# EAGLE schematic watch (EAGLE 6.4)
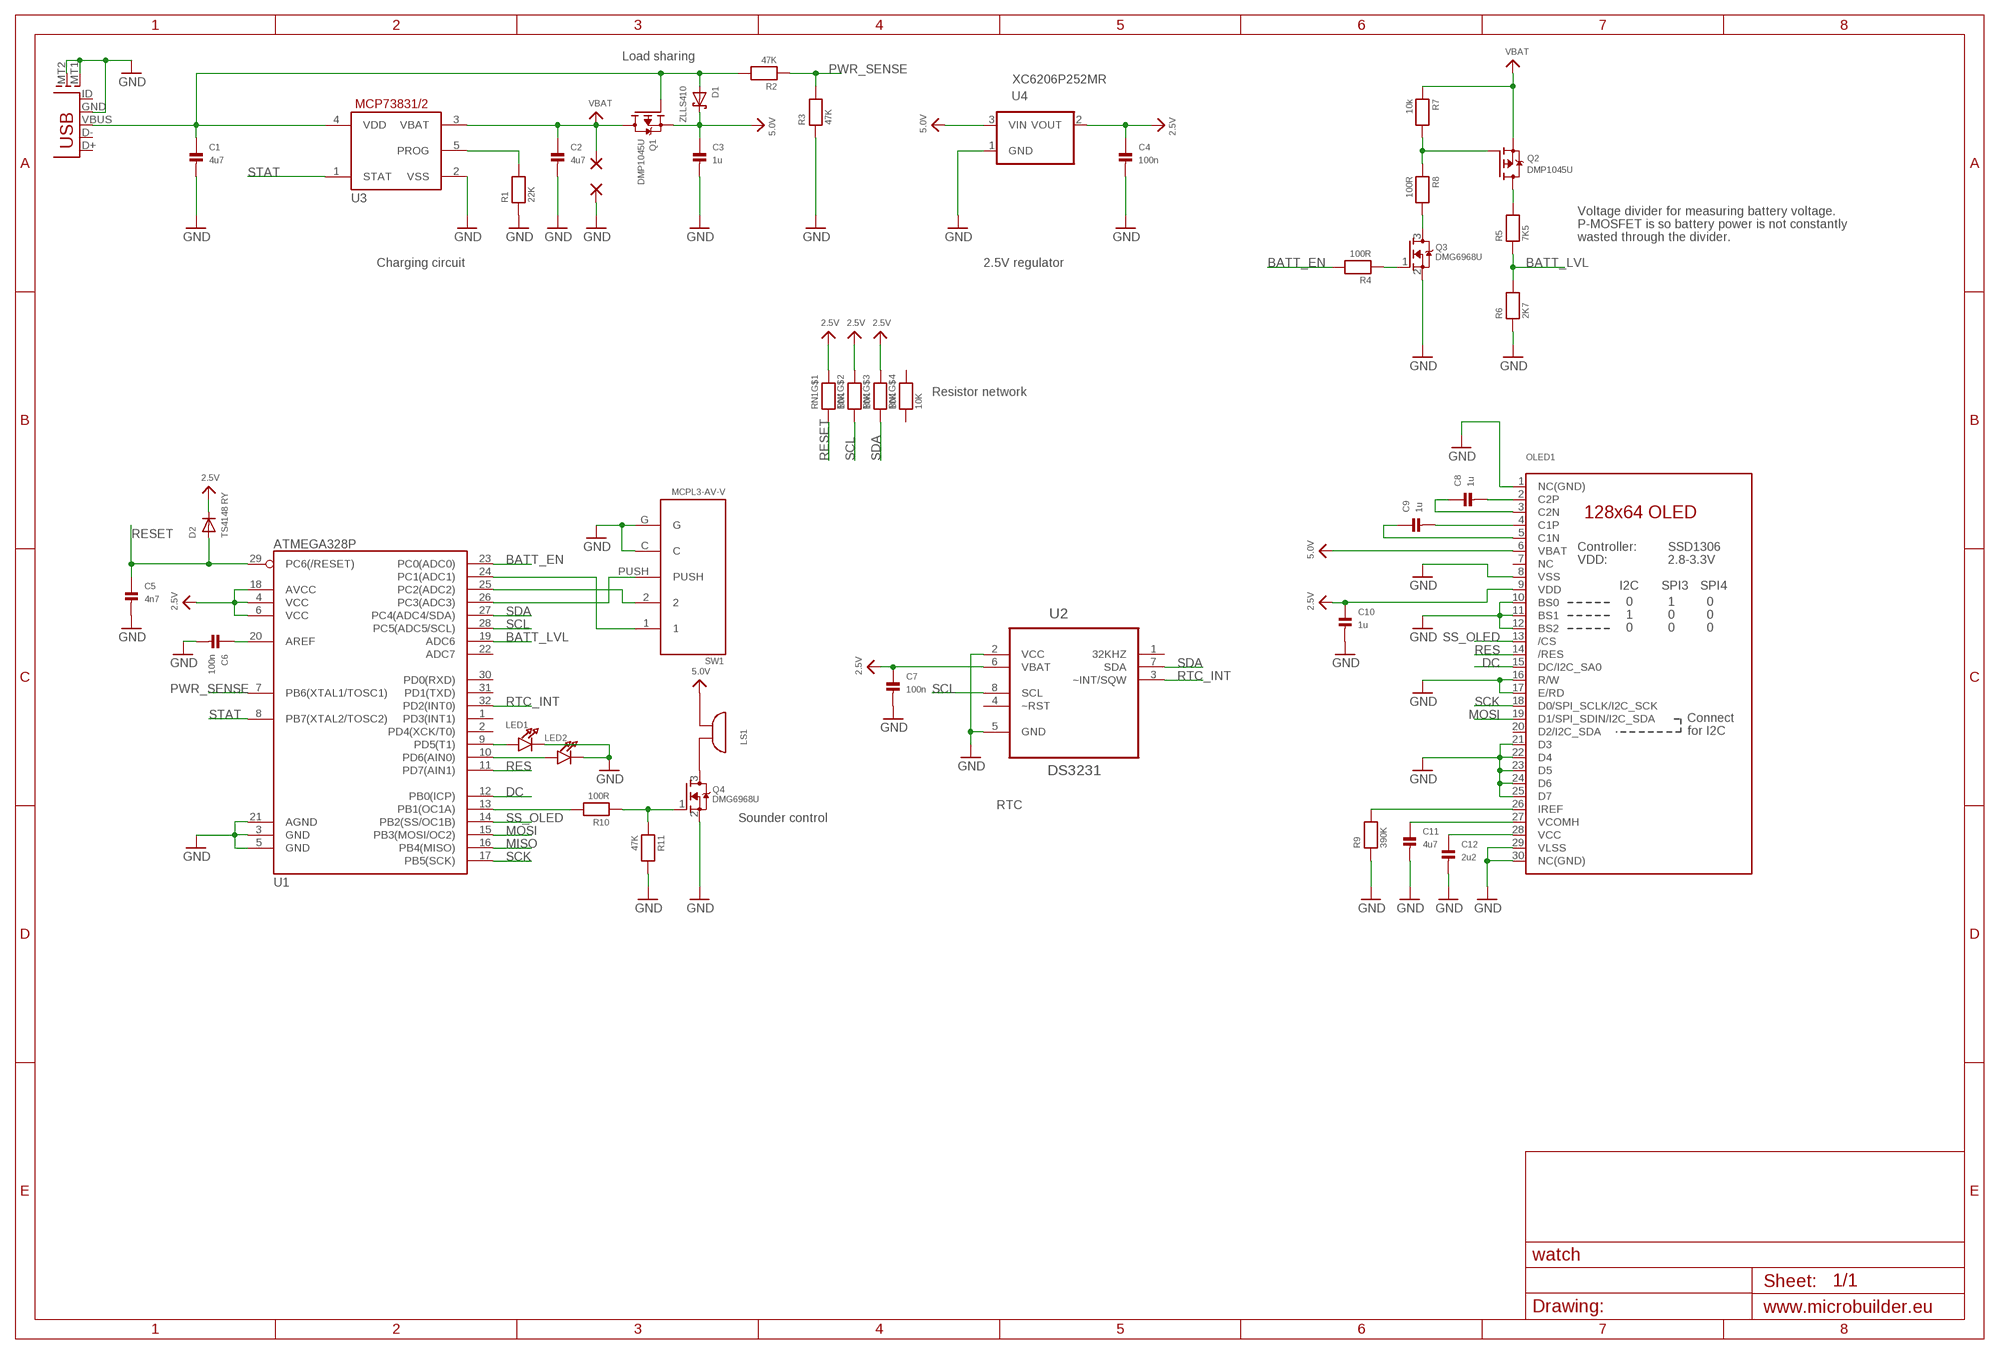
[diagram p0: schematic, sheet 1]

## Parts
C1  4u7  CAP_CERAMIC0805  [0805]
C2  4u7  CAP_CERAMIC0805  [0805]
C3  1u  CAP_CERAMIC0805  [0805]
C4  100n  CAP_CERAMIC0805  [0805]
C5  4n7  CAP_CERAMIC0805  [0805]
C6  100n  CAP_CERAMIC0805  [0805]
C7  100n  CAP_CERAMIC0805  [0805]
C8  1u  CAP_CERAMIC0805  [0805]
C9  1u  CAP_CERAMIC0805  [0805]
C10  1u  CAP_CERAMIC0805  [0805]
C11  4u7  CAP_CERAMIC0805  [0805]
C12  2u2  CAP_CERAMIC0805  [0805]
D1  ZLLS410  DIODE-SCHOTTKYSOD-323  [SOD-323]
D2  TS4148 RY  DIODE0805  [DIODE0805]
LED1  LED0805  [CHIPLED_0805]
LED2  LED0805  [CHIPLED_0805]
LS1  ABMT-801-RC  [PIEZO]
OLED1  DISP_OLED_UG-2864HSWEG01_NOOUTLINE  [UG-2864HSWEG01_1.3_WRAPAROUND]
PAD1  SMD2  [SMD1,27-2,54]
PAD2  SMD2  [SMD1,27-2,54]
Q1  DMP1045U  MOSFET-PWIDE  [SOT23-WIDE]
Q2  DMP1045U  MOSFET-PWIDE  [SOT23-WIDE]
Q3  DMG6968U  MOSFET-NWIDE  [SOT23-WIDE]
Q4  DMG6968U  MOSFET-NWIDE  [SOT23-WIDE]
R1  22K  RESISTOR0805  [0805]
R2  47K  RESISTOR0805_NOTHERMALS  [0805_NOTHERMALS]
R3  47K  RESISTOR0805_NOTHERMALS  [0805_NOTHERMALS]
R4  100R  RESISTOR0805  [0805]
R5  7K5  RESISTOR0805  [0805]
R6  2K7  RESISTOR0805  [0805]
R7  10k  RESISTOR0805  [0805]
R8  100R  RESISTOR0805  [0805]
R9  390K  RESISTOR0805  [0805]
R10  100R  RESISTOR0805  [0805]
R11  47K  RESISTOR0805  [0805]
RN1  10K  RESISTOR_4PACK  [RESPACK_4X0603]
SW1  MCPL3-AV-V  [MCPL3-AC-V]
U1  ATMEGA328P  ATMEGA328_SMT  [TQFP32-08]
U2  DS3231  DS3231MZ+  [SOIC8_150MIL]
U3  MCP73832T-2ACI/OT  MCP73831/OT  [SOT23-5L]
U4  XC6206P252MR  MCP1700T-2502E/TTWIDE_PAD  [SOT-23]
USB1  USB-MICROBLARGEPAD  [USB-MICROB_LARGEPAD]

## Nets
2.5V: C4.1 C7.1 C10.1 D2.2(C) OLED1.9(VDD) RN1.6 RN1.7 RN1.8 U1.4(VCC) U1.6(VCC) U1.18(AVCC) U2.6(VBAT) U4.2(VOUT)
5.0V: C3.1 D1.C LS1.1(VCC) OLED1.6(VBAT) Q1.2(S) U4.3(VIN)
BATT_EN: R4.2 U1.23(PC0(ADC0))
BATT_LVL: R5.1 R6.2 U1.19(ADC6)
DC: OLED1.15(DC/I2C_SA0) U1.12(PB0(ICP))
GND: C1.2 C2.2 C3.2 C4.2 C5.2 C6.2 C7.2 C10.2 C11.2 C12.2 LED1.C LED2.C OLED1.1(NC(GND)) OLED1.8(VSS) OLED1.10(BS0) OLED1.11(BS1) OLED1.12(BS2) OLED1.16(R/W) OLED1.17(E/RD) OLED1.21(D3) OLED1.22(D4) OLED1.23(D5) OLED1.24(D6) OLED1.25(D7) OLED1.29(VLSS) OLED1.30(NC(GND)) PAD2.1(P) Q3.2(S) Q4.2(S) R1.1 R3.1 R6.1 R9.1 R11.2 SW1.C SW1.G U1.3(GND) U1.5(GND) U1.21(AGND) U2.2(VCC) U2.5(GND) U3.2(VSS) U4.1(GND) USB1.GND USB1.MT1(SHEILD1) USB1.MT2(SHEILD2)
MISO: U1.16(PB4(MISO))
MOSI: OLED1.19(D1/SPI_SDIN/I2C_SDA) U1.15(PB3(MOSI/OC2))
N$1: C6.1 U1.20(AREF)
N$2: SW1.1 U1.24(PC1(ADC1))
N$3: C8.2 OLED1.2(C2P)
N$4: SW1.2 U1.25(PC2(ADC2))
N$5: OLED1.26(IREF) R9.2
N$6: C1.1 D1.A Q1.1(G) R2.2 U3.4(VDD) USB1.VBUS
N$7: LS1.2(GND) Q4.3(D)
N$8: Q4.1(G) R10.1 R11.1
N$9: SW1.PUSH U1.26(PC3(ADC3))
N$10: R1.2 U3.5(PROG)
N$11: LED1.A U1.9(PD5(T1))
N$12: Q2.1(G) R7.2 R8.1
N$13: C9.1 OLED1.5(C1N)
N$14: C9.2 OLED1.4(C1P)
N$15: C8.1 OLED1.3(C2N)
N$16: LED2.A U1.10(PD6(AIN0))
N$17: Q3.3(D) R8.2
N$18: Q2.3(D) R5.2
N$19: C11.1 OLED1.27(VCOMH)
N$20: C12.1 OLED1.28(VCC)
N$21: Q3.1(G) R4.1
PIEZO: R10.2 U1.13(PB1(OC1A))
PWR_SENSE: R2.1 R3.2 U1.7(PB6(XTAL1/TOSC1))
RES: OLED1.14(/RES) U1.11(PD7(AIN1))
RESET: C5.1 D2.1(A) RN1.1 U1.29(PC6(/RESET))
RTC_INT: U1.32(PD2(INT0)) U2.3(~INT/SQW)
SCK: OLED1.18(D0/SPI_SCLK/I2C_SCK) U1.17(PB5(SCK))
SCL: RN1.2 U1.28(PC5(ADC5/SCL)) U2.8(SCL)
SDA: RN1.3 U1.27(PC4(ADC4/SDA)) U2.7(SDA)
SS_OLED: OLED1.13(/CS) U1.14(PB2(SS/OC1B))
STAT: U1.8(PB7(XTAL2/TOSC2)) U3.1(STAT)
VBAT: C2.1 PAD1.1(P) Q1.3(D) Q2.2(S) R7.1 U3.3(VBAT)
Unconnected: OLED1.7(NC) OLED1.20(D2/I2C_SDA) RN1.4 RN1.5 U1.1(PD3(INT1)) U1.2(PD4(XCK/T0)) U1.22(ADC7) U1.30(PD0(RXD)) U1.31(PD1(TXD)) U2.1(32KHZ) U2.4(~RST) USB1.D+ USB1.D- USB1.ID

## Notes on the sheet
- Load sharing
- Voltage divider for measuring battery voltage.
- P-MOSFET is so battery power is not constantly
- wasted through the divider.
- Charging circuit | 2.5V regulator
- Resistor network
- RTC
- Sounder control

## Library data of the parts
C1-C12 = microbuilder:CAP_CERAMIC: Ceramic Capacitors 0402 - 0402 Surface Mount Capacitors 16pF 50V 5% [Digikey: 445-4899-2-ND] 18pF 50V 5% [Digikey: 490-1281-2-ND] 22pF 50V 5% [Digikey: 490-1283-2-ND] 68pF 50V 5% [Digikey: 490-1289-2-ND] 0.1uF 10V 10% [Digikey: 490-1318-2-ND] 1.0uF 6.3V 10% [Digikey: 490-1320-2-ND] 0603 - 0603 Surface Mount Capacitors 16 pF 50V 5% [Digikey: 445-5051-2-ND] 22 pF 50V [Digikey: PCC220ACVTR-ND] 33 pF 50V 5% [Digikey: 490-1415-1-ND] 56pF 50V 5% [Digikey: 490-1421-1-ND] 220pF 50V 5% [Digikey: 445-1285-1-ND] 680 pF 50V 2200 pF 50V 5% C0G [Digikey: 445-1297-1-ND] 5600 pF 100V 5% X7R [Digikey: 478-3711-1-ND] 0.1 µF 25V 10% [Digikey: PCC2277TR-ND] 0.22 µF 16V 10% X7R [Digikey: 445-1318-1-ND] 1.0 µF 25V 10% [Digikey: 445-5146-2-ND] 0603 - RF Specific 3pF 250V +/-0.1pF RF [Digikey: 712-1347-1-ND] 18 pF 250V 5% [Digikey: 478-3505-1-ND or 712-1322-1-ND] 56 pF 250V 5% C0G RF [Digikey: 490-4867-1-ND] 68 pF 250V RF [Digikey: 490-4868-1-ND] 0805 - 0805 Surface Mount Capacitors 220 pF 250V 2% RF Ceramic Capacitor [Digikey: 712-1398-1-ND] 1000 pF 50V 2% NP0 Ceramic Capacitor [Digikey: 478-3760-1-ND] 0.1 µF 25V 10% Ceramic Capacitor [Digikey: PCC1828TR-ND] 1.0 µF 16V 10% Ceramic Capacitor[Digikey: 490-1691-2-ND] 10.0 µF 10V 10% Ceramic Capacitor[Digikey: 709-1228-1-ND] 10.0 uF 16V 10% Ceramic Capacitor [Digikey: 478-5165-2-ND] 47 uF 6.3V 20% Ceramic Capacitor [Digikey: 587-1779-1-ND or 399-5506-1-ND] 1206 - 1206 Surface Mount Capacitors 47uF 10V 20% Ceramic Capacitor [Digikey: 490-5528-1-ND or 399-5508-1-ND or 445-6010-1-ND] 100uF 6.3V -20%, +80% Y5V Ceramic Capacitor (Digikey: 490-4512-1-ND, Mouser: 81-GRM31CF50J107ZE1L)
D1 = zak:DIODE-SCHOTTKY
D2 = diode0805:DIODE0805
LED1 LED2 = microbuilder:LED: LED 0603 - 0603 Surface Mount Package 2mA: Green LED - Low Power (3.9mcd, 2ma, 1.7Vf) - Digikey: 475-2709-2-ND Orange LED - Low Power (9.8mcd, 2ma, 1.8Vf) - Digikey: 475-1194-2-ND Red LED - Low Power (5mcd, 2ma, 1.8Vf) - Digikey: 475-1195-2-ND Yellow LED - Low Power (7mcd, 2ma, 1.8Vf) - Digikey: 475-1196-2-ND 5mA: Blue LED - Low Power (17mcd, 5ma, 2.9Vf) - Digikey: LNJ937W8CRACT-ND 0805 - 0805 Surface Mount Package 2mA: Red LED (8.8mcd, 2mA, 1.8Vf, Clear) - Low Power [Digikey: 475-2510-1-ND] Green LED (5mcd, 2mA, 1.8Vf, Clear) - Low Power [Digikey: 475-2730-1-ND] Yellow LED (11.3mcd, 2mA, 1.8Vf, Clear) - Low Power [Digikey: 475-2555-1-ND] 20mA: Red LED (104mcd, 20mA, Diffused) - LS R976 [Digikey: 475-1278-6-ND] Red LED (12mcd, 20mA, 2.0Vf, Clear) - APT2012EC [Digikey: 754-1128-1-ND] Green LED (15mcd, 20mA, 2.2Vf, Clear) - APT2012GC [Digikey: 754-1131-1-ND] Orange LED (160mcd, 20mA, 2.1Vf, Clear) - APT2012SECK [Digikey: 754-1130-1-ND] 1206 - 1206 Surface Mount Package Green LED (26mcd, 20mA, Diffused) - LG N971 [Digikey: 475-1407-6-ND] Red LED (15mcd, 20mA, Diffused) - LH N974 [Digikey: 475-1416-6-ND]
LS1 = zak:ABMT-801-RC
OLED1 = zak:DISP_OLED_UG-2864HSWEG01_NOOUTLINE
PAD1 PAD2 = wirepad:SMD2: SMD PAD
Q1 Q2 = microbuilder:MOSFET-P: P-Channel Mosfet LEGEND VDS: Voltage Drain-Source ID: Drain Current RDS(ON): Drain-Source On-State Resistance VGS(TH): Gate-Source Threshold Voltage CISS: Drain-Source Input Capacitance SOT-23 Name VDS ID RDS(ON) VGS(TH) CISS Order Number IRLML5103 30V 760mA 600 mOhm -- 75pF @ 25V Digikey: IRLML5103PBFCT-ND IRLML6401 12V 4.3A 50 mOhm 950mV @ 250µA 830pF @ 10V Digikey: IRLML6401PBFTR-ND NTR0202PL 20V 400mA 800 mOhm 2.3V @ 250uA 70pF @ 5V Digikey: NTR0202PLT1GOSTR-ND NTR4101PT1G 20V 1.8A 85 mOhm 1.2V @ 250uA 675pF @ 10V Digikey: NTR4101PT1GOSCT-ND DMP2004K 20V 600mA 900 mOhm 1V @ 250uA 175pF @ 16V Digikey: DMP2004KDICT-ND PMV65XP 20V 3.9A 76 mOhm 950mV @ 1mA 725pF @ 20V Digikey: 568-2358-2-ND TO-252 Name VDS ID RDS(ON) VGS(TH) CISS Order Number AOD417 30V 25A 34 mOhm 3V @ 250µA 920pF @ 15V Digikey: 785-1106-2-ND
Q3 Q4 = microbuilder:MOSFET-N: N-Channel Mosfet LEGEND VDS: Voltage Drain-Source ID: Drain Current RDS(ON): Drain-Source On-State Resistance VGS(TH): Gate-Source Threshold Voltage CISS: Drain-Source Input Capacitance SOT-23 Name VDS ID RDS(ON) VGS(TH) CISS Order Number 2N7002E 60V 260mA 2.5 Ohm 2.5V @ 250uA 26.7pF @ 25V 2N7002ET1GOSTR-ND BSH103 30V 850mA 400 mOhm 400mV @ 1mA 83pF @ 24V BSH103,235-ND BSS138 60V 320mA 1.6 Ohm 1.5V @ 250uA 50pF @ 10V Mouser: 771-BSS138PW115 DMN2075U-7 20V 4.2A 38 mOhm 1V @ 250 uA 594.3pF @ 10V DMN2075U-7DICT-ND * BSS138 good choice for I2C level-shifting
R1-R11 = microbuilder:RESISTOR: Resistors 0402 - 0402 Surface Mount Package 22 Ohm 1% 1/16W [Digikey: 311-22.0LRTR-ND] 33 Ohm 5% 1/16W 1.0K 5% 1/16W 1.5K 5% 1/16W 2.0K 1% 1/16W 10.0K 1% 1/16W [Digikey: 311-10.0KLRTR-ND] 10.0K 5% 1/16W [Digikey: RMCF0402JT10K0TR-ND] 12.1K 1% 1/16W [Digikey: 311-22.0LRTR-ND] 100.0K 5% 1/16W 0603 - 0603 Surface Mount Package 0 Ohm 1/10 Watt 1% Resistor 15 Ohm 1/10 Watt 1% Resistor 33 Ohm 1/10 Watt 1% Resistor 49.9 Ohm 1/10 Watt 1% Resistor 100 Ohm 1/10 Watt 1% Resistor 150 Ohm 1/10 Watt 1% Resistor 240 Ohm 1/10 Watt 1% Resistor 390 Ohm 1/10 Watt 1% Resistor 560 Ohm 1/10 Watt 1% Resistor 680 Ohm 1/10 Watt 1% Resistor 750 Ohm 1/10 Watt 1% Resistor 1.0K Ohm 1/10 Watt 1% Resistor 1.5K Ohm 1/10 Watt 1% Resistor 2.0K Ohm 1/10 Watt 1% Resistor 2.2K Ohm 1/10 Watt 1% Resistor 3.3K Ohm 1/10 Watt 1% Resistor 4.7K Ohm 1/10 Watt 1% Resistor 10.0K Ohm 1/10 Watt 1% Resistor 12.0K Ohm 1/10 Watt 1% Resistor 12.1K Ohm 1/10 Watt 1% Resistor 20.0K Ohm 1/10 Watt 1% Resistor 33.0K Ohm 1/10 Watt 1% Resistor 100.0K Ohm 1/10 Watt 1% Resistor 0805 - 0805 Surface Mount Package 0 Ohm 1/8 Watt 1% Resistor 33 Ohm 1/8 Watt 1% Resistor 100 Ohm 1/8 Watt 1% Resistor 150 Ohm 1/8 Watt 1% Resistor 200 Ohm 1/8 Watt 1% Resistor 240 Ohm 1/8 Watt 1% Resistor 330 Ohm 1/8 Watt 1% Resistor 390 Ohm 1/8 Watt 1% Resistor 470 Ohm 1/8 Watt 1% Resistor 1.0K Ohm 1/8 Watt 1% Resistor 1.5K Ohm 1/8 Watt 1% Resistor 2.0K Ohm 1/8 Watt 1% Resistor 4.7K Ohm 1/8 Watt 1% Resistor 5.1K Ohm 1/8 Watt 1% Resistor 5.6K Ohm 1/8 Watt 1% Resistor 10.0K Ohm 1/8 Watt 1% Resistor 22.0K Ohm 1/8 Watt 1% Resistor 33.0K Ohm 1/8 Watt 1% Resistor 100K Ohm 1/8 Watt 1% Resistor 1206 - 1206 Surface Mount Package 2012 - 2010 Surface Mount Package 0.11 Ohm 1/2 Watt 1% Resistor - Digikey: RHM.11UCT-ND
RN1 = microbuilder:RESISTOR_4PACK: Resistor Packs (4 resistors) 4 x 0603 10K 1/16W - Digikey: YC164J-10KCT-ND
SW1 = zak:MCPL3-AV-V
U1 = SparkFun-DigitalIC:ATMEGA328_SMT: 32-Pin Atmega328 part Commonly used on Arduino compatible boards Available in QFP and QFN packages TQFP is IC-09069 QFN is non-stock; PROD_ID: IC-09069
U2 = zak:DS3231MZ+
U3 = adafruit:MCP73831: MCP73831/2 Miniature Single-Cell, Fully Integrated Li-Ion, Li-Polymer Charge Management Controllers. Nice and small simple lipoly charge controller, with adjustable current and status output (LED) http://www.ladyada.net/library/pcb/eaglelibrary.html
U4 = zak:MCP1700T-2502E/TT: Low Quiescent Current LDO
USB1 = zak:USB-MICROB